# Altium schematic sheet RPL_MCU_E.SchDoc: MCU Breakouts
size A; Date: Dec 27,2017; DrawnBy: Seyed Omid Hasanli; Revision: 1.0; SheetNumber: 10
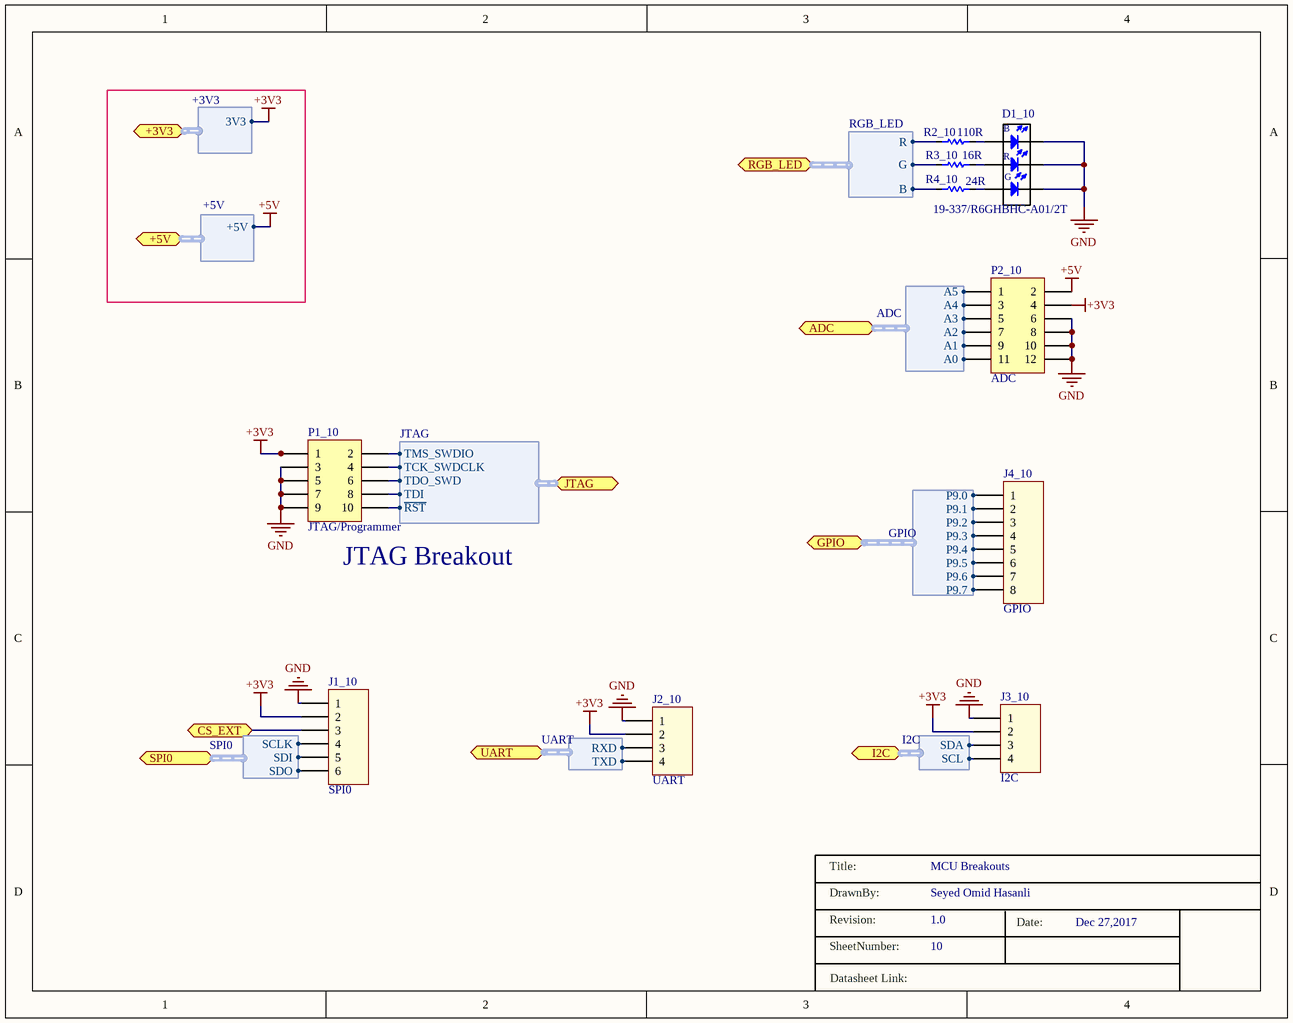
[diagram p0: RPL_MCU_E.SchDoc]

## Parts
D1_10  19-337/R6GHBHC-A01/2T  [LED_19-337/R6GHBHC-A01/2T]
J1_10  SPI0  [665306124022]
J2_10  UART  [665104131822]
J3_10  I2C  [665104131822]
J4_10  GPIO  [665308124022]
P1_10  JTAG/Programmer  [FTSH-105-01-XXX-D-K]
P2_10  ADC  [HDR2X6]
R2_10  value 110R  [RES 0805]  (hidden comment: Res)
R3_10  value 16R  [RES 0805]  (hidden comment: Res)
R4_10  value 24R  [RES 0805]  (hidden comment: Res)

## Ports
+3V3 (harness +3V3), +5V (harness +5V), ADC (harness ADC), CS_EXT, GPIO (harness GPIO), I2C (harness I2C), JTAG (harness JTAG), RGB_LED (harness RGB_LED), SPI0 (harness SPI0), UART (harness UART)

## Harnesses
JTAG: TMS_SWDIO, TCK_SWDCLK, TDO_SWD, TDI, ~{RST}
RGB_LED: R, G, B
+3V3: 3V3
ADC: A5, A4, A3, A2, A1, A0
+5V: +5V
SPI0: SCLK, SDI, SDO
UART: RXD, TXD
I2C: SDA, SCL
GPIO: P9.0, P9.1, P9.2, P9.3, P9.4, P9.5, P9.6, P9.7

## Nets
+3V3: J1_10.2 J2_10.2 J3_10.2 P1_10.1 P2_10.4 ; port +3V3.3V3
+5V: P2_10.2 ; port +5V.+5V
GND: D1_10.1(C1) D1_10.2(C2) D1_10.3(C3) J1_10.1 J2_10.1 J3_10.1 P1_10.3 P1_10.5 P1_10.7 P1_10.9 P2_10.6 P2_10.8 P2_10.10 P2_10.12
CS_EXT: J1_10.3 ; port CS_EXT
NetD1_10_4: D1_10.4(A1) R2_10.2
NetD1_10_5: D1_10.5(A2) R3_10.2
NetD1_10_6: D1_10.6(A3) R4_10.2
NetJ1_10_4: J1_10.4 ; port SPI0.SCLK
NetJ1_10_5: J1_10.5 ; port SPI0.SDI
NetJ1_10_6: J1_10.6 ; port SPI0.SDO
NetJ2_10_3: J2_10.3 ; port UART.RXD
NetJ2_10_4: J2_10.4 ; port UART.TXD
NetJ3_10_3: J3_10.3 ; port I2C.SDA
NetJ3_10_4: J3_10.4 ; port I2C.SCL
NetJ4_10_1: J4_10.1 ; port GPIO.P9.0
NetJ4_10_2: J4_10.2 ; port GPIO.P9.1
NetJ4_10_3: J4_10.3 ; port GPIO.P9.2
NetJ4_10_4: J4_10.4 ; port GPIO.P9.3
NetJ4_10_5: J4_10.5 ; port GPIO.P9.4
NetJ4_10_6: J4_10.6 ; port GPIO.P9.5
NetJ4_10_7: J4_10.7 ; port GPIO.P9.6
NetJ4_10_8: J4_10.8 ; port GPIO.P9.7
NetP1_10_2: P1_10.2 ; port JTAG.TMS_SWDIO
NetP1_10_4: P1_10.4 ; port JTAG.TCK_SWDCLK
NetP1_10_6: P1_10.6 ; port JTAG.TDO_SWD
NetP1_10_8: P1_10.8 ; port JTAG.TDI
NetP1_10_10: P1_10.10 ; port JTAG.~{RST}
NetP2_10_1: P2_10.1 ; port ADC.A5
NetP2_10_3: P2_10.3 ; port ADC.A4
NetP2_10_5: P2_10.5 ; port ADC.A3
NetP2_10_7: P2_10.7 ; port ADC.A2
NetP2_10_9: P2_10.9 ; port ADC.A1
NetP2_10_11: P2_10.11 ; port ADC.A0
NetR2_10_1: R2_10.1 ; port RGB_LED.R
NetR3_10_1: R3_10.1 ; port RGB_LED.G
NetR4_10_1: R4_10.1 ; port RGB_LED.B

## Notes on the sheet
- (near P1_10) JTAG Breakout
- Title:
- DrawnBy:
- Revision:
- SheetNumber:
- Date:
- Datasheet Link:
- (in symbol LED 19-337/R6GHBHC-A01/2T) B; R; G

## Library data of the parts
D1_10 = LED 19-337/R6GHBHC-A01/2T: LED Tri-Color Blue/Green/Red 468nm/518nm/632nm 6-Pin T/R; MF: Everlight; Package: SMD-2 Everlight; Price: 0.17 USD; MP: 19-337/R6GHBHC-A01/2T; Availability: Good; Value: *
J1_10 = 665306124022: WR-WTB 1.00 mm SMT Male Vertical Shrouded Header, 6p; Pitch: 1 mm; Pin Number: 6; ComponentLink1Description: Manufacturer; ComponentLink1URL: http://www.we-online.de; ComponentLink2Description: Datasheet; ComponentLink2URL: http://katalog.we-online.de/em/datasheet/6653xx124022.pdf; Part Number: 665306124022; Published Date: June 2017; Publisher: Wurth Elektronik
J2_10 J3_10 = 665104131822: WR-WTB 1.00 mm SMT Male Horizontal Shrouded, 4p; Pitch: 1 mm; Pin Number: 4; ComponentLink1Description: Manufacturer; ComponentLink1URL: http://www.we-online.de; ComponentLink2Description: Datasheet; ComponentLink2URL: http://katalog.we-online.de/em/datasheet/6651xx131822.pdf; Part Number: 665104131822; Published Date: June 2017; Publisher: Wurth Elektronik
J4_10 = 665308124022: WR-WTB 1.00 mm SMT Male Vertical Shrouded Header, 8p; Pitch: 1 mm; Pin Number: 8; ComponentLink1Description: Manufacturer; ComponentLink1URL: http://www.we-online.de; ComponentLink2Description: Datasheet; ComponentLink2URL: http://katalog.we-online.de/em/datasheet/6653xx124022.pdf; Part Number: 665308124022; Published Date: June 2017; Publisher: Wurth Elektronik
P1_10 = Header 5X2: Header, 5-Pin, Dual row; LatestRevisionDate: 17-Jul-2002; LatestRevisionNote: Re-released for DXP Platform.; Publisher: Altium Limited
P2_10 = Header 6X2: Header, 6-Pin, Dual row; LatestRevisionDate: 17-Jul-2002; LatestRevisionNote: Re-released for DXP Platform.; Publisher: Altium Limited